# EAGLE design RobotPCB (EAGLE 9.2.2)
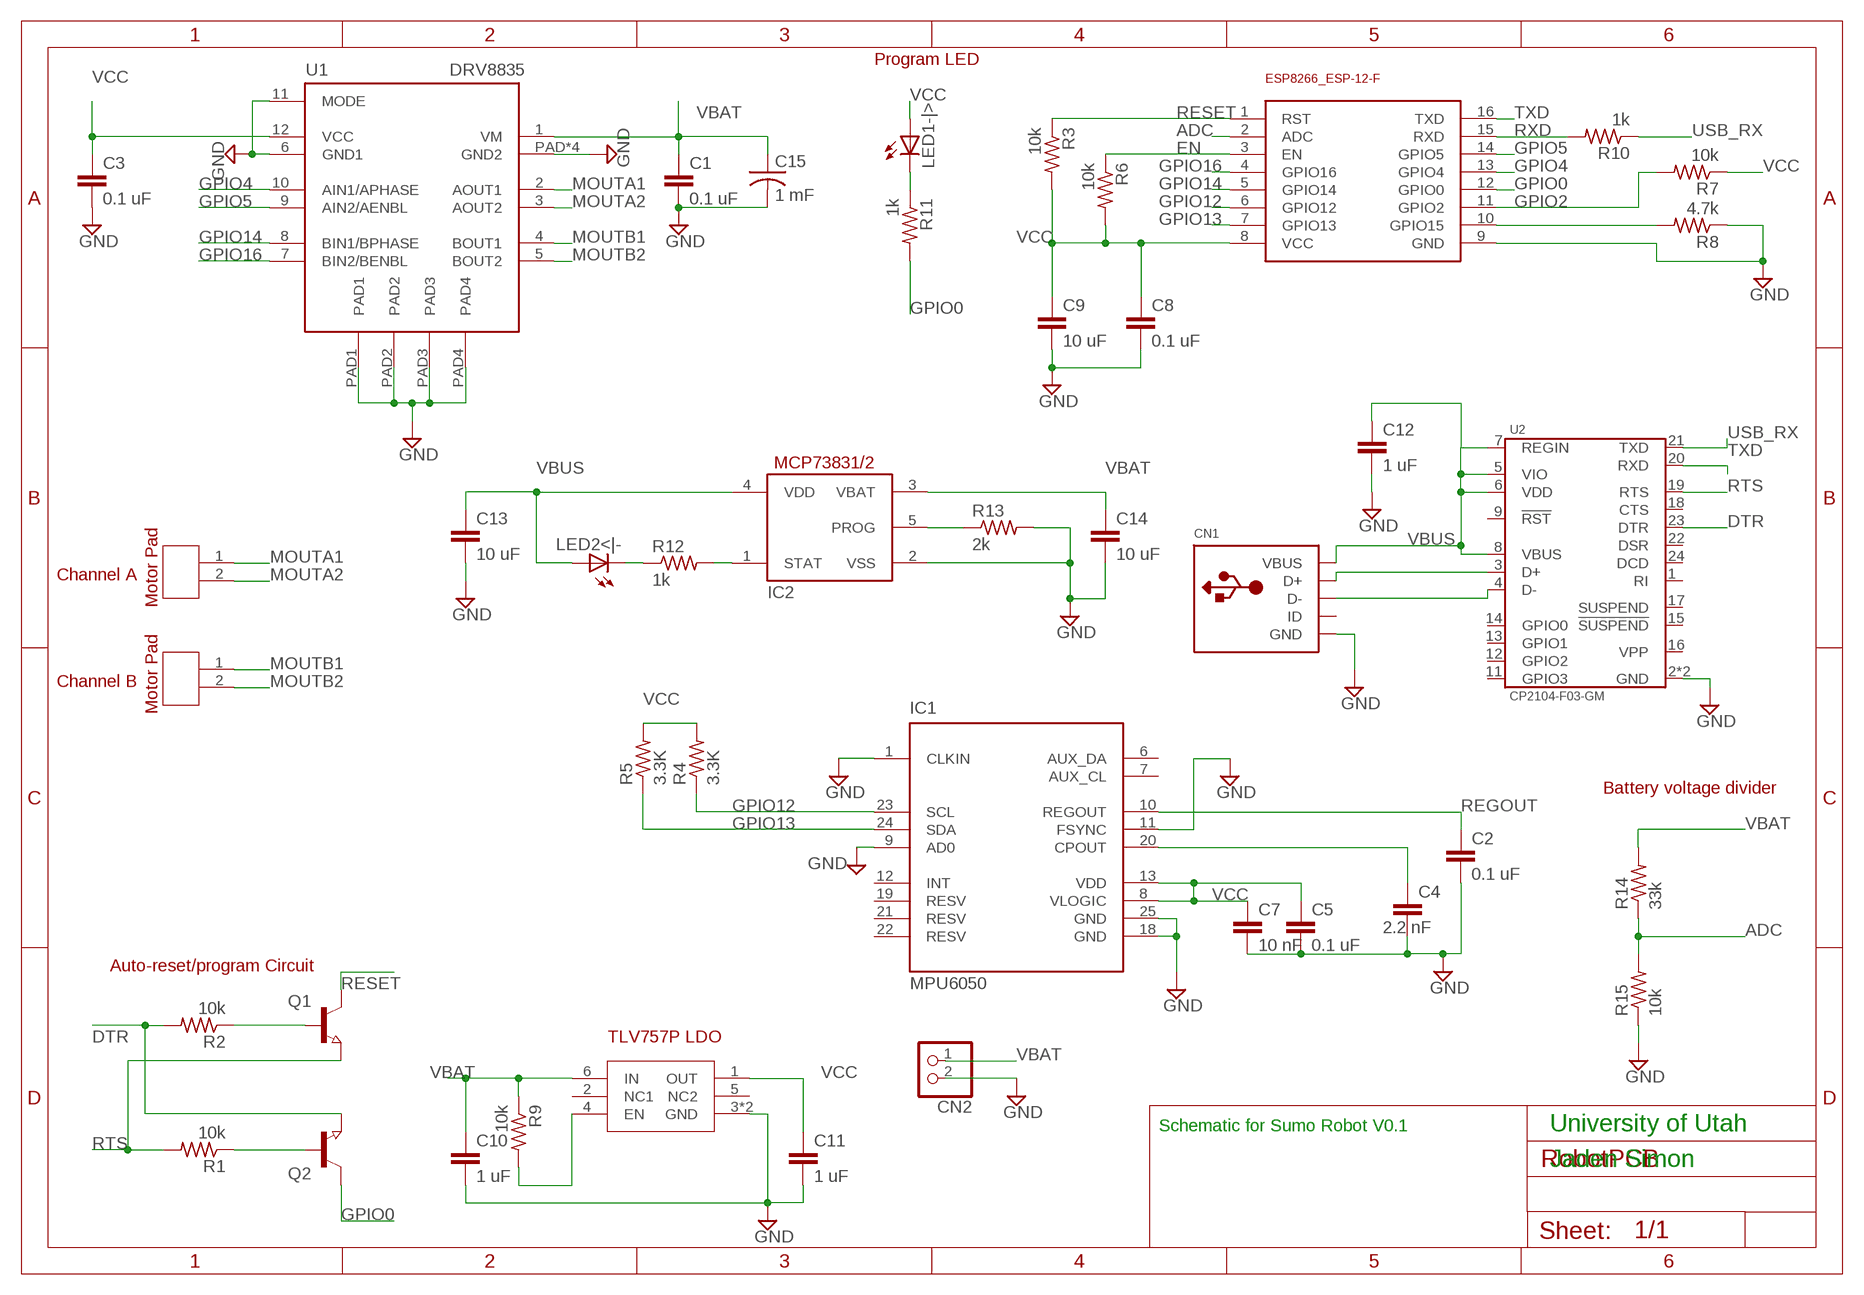
[diagram p0: schematic, sheet 1]

## Parts
C1  0.1 uF  C-EUC1206  [C1206]
C2  0.1 uF  C-EUC1206  [C1206]
C3  0.1 uF  C-EUC1206  [C1206]
C4  2.2 nF  C-EUC1206  [C1206]
C5  0.1 uF  C-EUC1206  [C1206]
C7  10 nF  C-EUC1206  [C1206]
C8  0.1 uF  C-EUC1206  [C1206]
C9  10 uF  C-EUC1206  [C1206]
C10  1 uF  C-EUC1206  [C1206]
C11  1 uF  C-EUC1206  [C1206]
C12  1 uF  C-EUC1206  [C1206]
C13  10 uF  C-EUC1206  [C1206]
C14  10 uF  C-EUC1206  [C1206]
C15  1 mF  C-US050-075X075  [C050-075X075]
CN1  USBMINIB  [USB-MINIB]
CN2  JST_2PIN-THM  [JST-PH-2-THM]
IC1  MPU6050  [QFN50P400X400X95-25T265X275N]
IC2  MCP73831/OT  [SOT23-5L]
LED1-|>  LEDSMT1206  [1206]
LED2<|-  LEDSMT1206  [1206]
Q1  NPN-TRANSISTOR_SOT23  [SOT23]
Q2  NPN-TRANSISTOR_SOT23  [SOT23]
R1  10k  R-US_M1206  [M1206]
R2  10k  R-US_M1206  [M1206]
R3  10k  R-US_M1206  [M1206]
R4  3.3K  R-US_M1206  [M1206]
R5  3.3K  R-US_M1206  [M1206]
R6  10k  R-US_M1206  [M1206]
R7  10k  R-US_M1206  [M1206]
R8  4.7k  R-US_M1206  [M1206]
R9  10k  R-US_M1206  [M1206]
R10  1k  R-US_M1206  [M1206]
R11  1k  R-US_M1206  [M1206]
R12  1k  R-US_M1206  [M1206]
R13  2k  R-US_M1206  [M1206]
R14  33k  R-US_M1206  [M1206]
R15  10k  R-US_M1206  [M1206]
U1  DRV8835  [WSON_2X3]
U2  CP2104-F03-GM  [QFN-24-4X4]
U$1  ESP8266_ESP-12  [ESP8266-ESP12]
U$2  TLV757P  [WSON-6]
U$3  MOTOR_PAD  [MOTOR_PAD]
U$4  MOTOR_PAD  [MOTOR_PAD]

## Nets
ADC: R14.1 R15.2 U$1.2(ADC)
DTR: Q2.2(E) R2.2 U2.23(DTR)
EN: R6.1 U$1.3(EN)
GND: C1.2 C2.2 C3.2 C4.2 C5.2 C7.2 C8.2 C9.2 C10.2 C11.2 C12.2 C13.2 C14.2 C15.2 CN1.GND CN2.2 IC1.1(CLKIN) IC1.9(AD0) IC1.11(FSYNC) IC1.18(GND) IC1.25(GND) IC2.2(VSS) R8.1 R13.2 R15.1 U1.6(GND1) U1.11(MODE) U1.PAD1 U1.PAD2 U1.PAD3 U1.PAD4 U1.PAD5(GND2) U1.PAD6(GND2) U1.PAD7(GND2) U1.PAD(GND2) U2.2(GND) U2.PAD(GND) U$1.9(GND) U$2.3(GND) U$2.7(GND)
GPIO0: Q2.3(C) R11.2 U$1.12(GPIO0)
GPIO2: R7.2 U$1.11(GPIO2)
GPIO4: U1.10(AIN1/APHASE) U$1.13(GPIO4)
GPIO5: U1.9(AIN2/AENBL) U$1.14(GPIO5)
GPIO12: IC1.23(SCL) R4.1 U$1.6(GPIO12)
GPIO13: IC1.24(SDA) R5.1 U$1.7(GPIO13)
GPIO14: U1.8(BIN1/BPHASE) U$1.5(GPIO14)
GPIO16: U1.7(BIN2/BENBL) U$1.4(GPIO16)
MOUTA1: U1.2(AOUT1) U$3.1(L)
MOUTA2: U1.3(AOUT2) U$3.2
MOUTB1: U1.4(BOUT1) U$4.1(L)
MOUTB2: U1.5(BOUT2) U$4.2
N$1: C4.1 IC1.20(CPOUT)
N$2: Q1.1(B) R2.1
N$3: R9.2 U$2.4(EN)
N$4: CN1.D+ U2.3(D+)
N$5: Q2.1(B) R1.1
N$7: CN1.D- U2.4(D-)
N$8: LED1-|>.C R11.1
N$9: IC2.5(PROG) R13.1
N$10: IC2.1(STAT) R12.2
N$11: LED2<|-.C R12.1
N$23: R8.2 U$1.10(GPIO15)
REGOUT: C2.1 IC1.10(REGOUT)
RESET: Q1.3(C) R3.1 U$1.1(RST)
RTS: Q1.2(E) R1.2 U2.19(RTS)
RXD: R10.2 U$1.15(RXD)
TXD: U2.20(RXD) U$1.16(TXD)
USB_RX: R10.1 U2.21(TXD)
VBAT: C1.1 C10.1 C14.1 C15.1 CN2.1 IC2.3(VBAT) R9.1 R14.2 U1.1(VM) U$2.6(IN)
VBUS: C12.1 C13.1 CN1.VBUS IC2.4(VDD) LED2<|-.A U2.5(VIO) U2.6(VDD) U2.7(REGIN) U2.8(VBUS)
VCC: C3.1 C5.1 C7.1 C8.1 C9.1 C11.1 IC1.8(VLOGIC) IC1.13(VDD) LED1-|>.A R3.2 R4.2 R5.2 R6.2 R7.1 U1.12(VCC) U$1.8(VCC) U$2.1(OUT)
Unconnected: CN1.ID IC1.2(NC) IC1.3(NC) IC1.4(NC) IC1.5(NC) IC1.6(AUX_DA) IC1.7(AUX_CL) IC1.12(INT) IC1.14(NC) IC1.15(NC) IC1.16(NC) IC1.17(NC) IC1.19(RESV) IC1.21(RESV) IC1.22(RESV) U2.1(RI) U2.9(!RST) U2.11(GPIO3) U2.12(GPIO2) U2.13(GPIO1) U2.14(GPIO0) U2.15(!SUSPEND) U2.16(VPP) U2.17(SUSPEND) U2.18(CTS) U2.22(DSR) U2.24(DCD) U$2.2(NC1) U$2.5(NC2)

## Notes on the sheet
- Program LED
- Channel A
- Channel B
- Battery voltage divider
- Auto-reset/program Circuit
- Schematic for Sumo Robot V0.1 | University of Utah
- Jaden Simon

## Library data of the parts
C1-C5 C7-C14 = rcl:C-EU: CAPACITOR, European symbol; SPICEPREFIX: C
C15 = rcl:C-US: CAPACITOR, American symbol; SPICEPREFIX: C
CN1 = adafruit:USB: USB Connectors USBMINIB - Surface Mount Female Mini-B USB Connector 4UConnector: 06564 By microbuilder.eu Thru-hole RA Female Mini-B USB Connector 4UConnector: 18732 By ladyada.net
CN2 = adafruit:JST_2PIN: JST 2-Pin Connectors of various flavors SMT-RA (S2B-PH-SM4) 4UConnector #17311 SMT (B2B-PH-SM4) THM-RA (S2B-PH) THM (B2B-PH)
IC1 = invensense:MPU6050: The triple-axis MEMS gyroscope
IC2 = adafruit:MCP73831: MCP73831/2 Miniature Single-Cell, Fully Integrated Li-Ion, Li-Polymer Charge Management Controllers. Nice and small simple lipoly charge controller, with adjustable current and status output (LED) http://www.ladyada.net/library/pcb/eaglelibrary.html
LED1-|> = adafruit:LED: LED
LED2<|- = led:LED: LED
Q1 Q2 = semicon-smd-ipc:NPN-TRANSISTOR_: NPN TRANSISTOR
R1-R15 = rcl:R-US_: RESISTOR, American symbol; SPICEPREFIX: R
U1 = bt_motordriver:DRV8835: DRV8835 DUAL LOW VOLTAGE H-BRIDGE IC The DRV8835 provides an integrated motor driver solution for cameras, consumer products, toys, and other low voltage or battery-powered motion control applications. The device has two H-bridge drivers, and can drive two DC motors or one stepper motor, as well as other devices like solenoids. The device has two H-bridge drivers, and drives two DC motors or one stepper motor, as well as other devices like solenoids. The output driver block for each consists of N-channel power MOSFETs configured as an H-bridge to drive the motor winding. An internal charge pump generates gate drive voltages. 1.5-A Maximum Drive Current Per H-Bridge Configure Bridges Parallel for 3-A Drive Curren 0-V to 11-V Motor-Operating Supply-Voltage 2-V to 7-V Logic Supply-Voltage Flexible PWM or PHASE/ENABLE Interface Low-Power Sleep Mode With 95-nA Maximum Supply Current Tiny 2.00-mm × 3.00-mm WSON Package Reference: http://www.ti.com/lit/ds/symlink/drv8835.pdf
U2 = silicon_labs:CP2104
U$1 = ESP8266:ESP8266_ESP-12
U$2 = ECE5780-MotorDriver:TLV757P
U$3 U$4 = ECE5780-MotorDriver:MOTOR_PAD

## Board
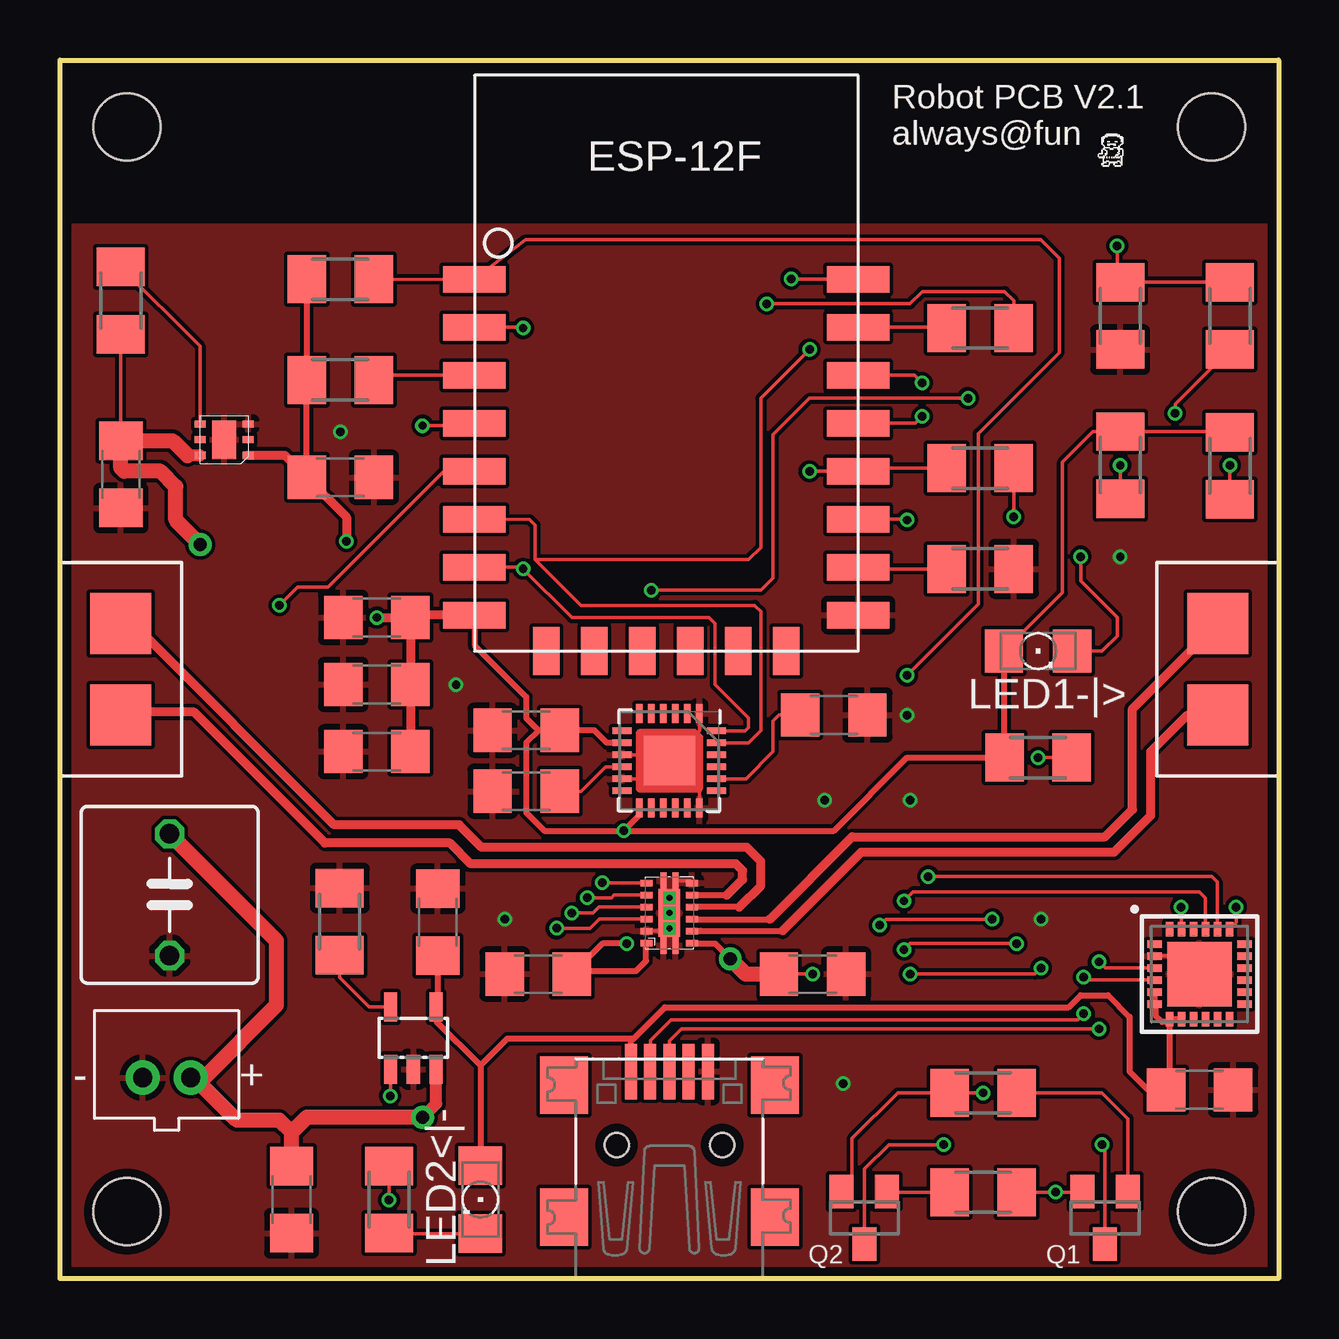
[diagram p1: board, top side]
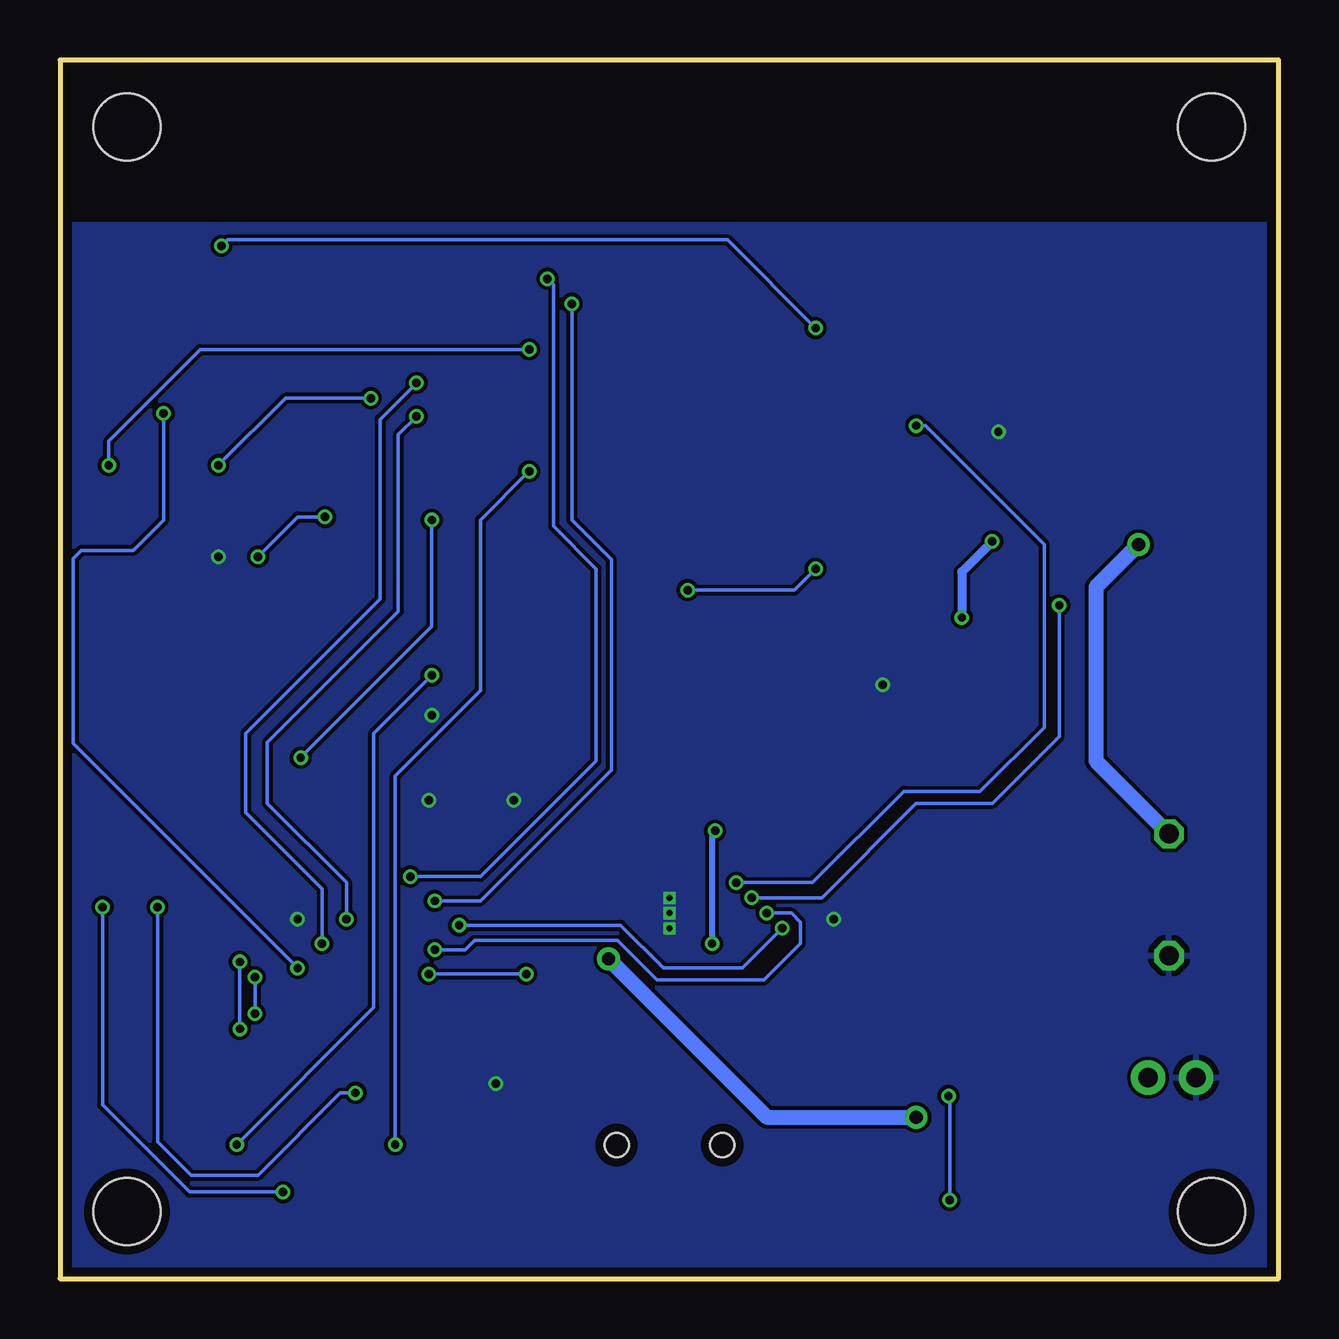
[diagram p2: board, bottom side, seen from below]

Size 50.8 x 50.8 mm. Coordinates in mm from the lower left corner, seen from the top.
Outline: 0,0 0,50.8 50.8,50.8 50.8,0 0,0
Copper layers (1*16): Top 0.035559375mm / dielectric 1.6mm / Bottom 0.035559375mm
Design rules "2layer": minimum track width 6mil, minimum drill 10mil, track to track 6mil, track to pad 6mil, pad to pad 6mil, via to via 6mil, smd to smd 6mil, copper to edge 15mil, drill to drill 6mil, minimum pad ring 5mil, minimum via ring 5mil, stop-mask expansion 2.5mil, vias tented up to drill 0mil, thermal gap 10mil
Holes 2.79 mm at 2.79,2.79 48.01,2.79 2.79,48.01 48.01,48.01

### Footprints (pad centres in the part's own frame; a part is rotated, then mirrored left to right if it is on the bottom)
C1206 = smd 1.6 x 1.8: 1 -1.4,0; 2 1.4,0
C050-075X075 = drill 0.813 octagon: 1 -2.54,0; 2 2.54,0
USB-MINIB = smd 0.5 x 2.308: D+ 0,4.064; D- -0.8,4.064; GND 1.6,4.064; ID 0.8,4.064; VBUS -1.6,4.064 | smd 2 x 2.4: GND1 -4.4,-2; GND2 -4.4,3.5; GND3 4.4,3.5; GND4 4.4,-2 | hole 1: -2.2,1; 2.2,1
JST-PH-2-THM = drill 0.8 pad 1.422: 1 1,0; 2 -1,0
QFN50P400X400X95-25T265X275N = smd 0.26 x 0.79: 1 -1.25,-1.97; 2 -0.75,-1.97; 3 -0.25,-1.97; 4 0.25,-1.97; 5 0.75,-1.97; 6 1.25,-1.97; 13 1.25,1.97; 14 0.75,1.97; 15 0.25,1.97; 16 -0.25,1.97; 17 -0.75,1.97; 18 -1.25,1.97 | smd 0.79 x 0.26: 7 1.97,-1.25; 8 1.97,-0.75; 9 1.97,-0.25; 10 1.97,0.25; 11 1.97,0.75; 12 1.97,1.25; 19 -1.97,1.25; 20 -1.97,0.75; 21 -1.97,0.25; 22 -1.97,-0.25; 23 -1.97,-0.75; 24 -1.97,-1.25 | smd 2.15 x 2.05: 25 0,0
SOT23-5L = smd 0.55 x 1.2: 1 -0.95,-1.3; 2 0,-1.3; 3 0.95,-1.3; 4 0.95,1.3; 5 -0.95,1.3
1206 = smd 1.6 x 1.803: A -1.422,0; C 1.422,0
SOT23 = smd 1 x 1.4: 1 -0.95,-1.1; 2 0.95,-1.1; 3 0,1.1
M1206 = smd 1.6 x 2: 1 -1.4,0; 2 1.4,0
WSON_2X3 = smd 0.28 x 0.5: 1 -1.25,-0.95; 2 -0.75,-0.95; 3 -0.25,-0.95; 4 0.25,-0.95; 5 0.75,-0.95; 6 1.25,-0.95; 7 1.25,0.95; 8 0.75,0.95; 9 0.25,0.95; 10 -0.25,0.95; 11 -0.75,0.95; 12 -1.25,0.95 | smd 2 x 0.9: PAD 0,0 | smd 0.7 x 0.25: PAD1 -1.35,0.25; PAD2 -1.35,-0.25; PAD3 1.35,-0.25; PAD4 1.35,0.25 | drill 0.254 pad 0.508 square: PAD5 -0.635,0; PAD6 0,0; PAD7 0.635,0
QFN-24-4X4 = smd 0.6 x 0.3: 1 -1.875,1.25; 2 -1.875,0.75; 3 -1.875,0.25; 4 -1.875,-0.25; 5 -1.875,-0.75; 6 -1.875,-1.25; 13 1.875,-1.25; 14 1.875,-0.75; 15 1.875,-0.25; 16 1.875,0.25; 17 1.875,0.75; 18 1.875,1.25 | smd 0.3 x 0.6: 7 -1.25,-1.875; 8 -0.75,-1.875; 9 -0.25,-1.875; 10 0.25,-1.875; 11 0.75,-1.875; 12 1.25,-1.875; 19 1.25,1.875; 20 0.75,1.875; 21 0.25,1.875; 22 -0.25,1.875; 23 -0.75,1.875; 24 -1.25,1.875 | smd 2.7 x 2.7: PAD 0,0
ESP8266-ESP12 = smd 2.6 x 1.1: 1 0,15.5; 2 0,13.5; 3 0,11.5; 4 0,9.5; 5 0,7.5; 6 0,5.5; 7 0,3.5; 8 0,1.5; 9 16,1.5; 10 16,3.5; 11 16,5.5; 12 16,7.5; 13 16,9.5; 14 16,11.5; 15 16,13.5; 16 16,15.5 | smd 1.1 x 2: 17 3,0; 18 5,0; 19 7,0; 20 9,0; 21 11,0; 22 13,0
WSON-6 = smd 0.45 x 0.3: 1 0,1.65; 2 0,1; 3 0,0.35; 4 2,0.35; 5 2,1; 6 2,1.65 | smd 1 x 1.6: 7 1,1
MOTOR_PAD = smd 2.54 x 2.54: 1 2.54,2.54; 2 6.35,2.54

### Placement (x,y rotation side)
C1  31.37,12.7 0 top
C2  19.43,20.32 180 top
C3  19.94,12.7 180 top
C4  32.26,23.5 0 top
C5  13.21,21.97 180 top
C7  19.43,22.86 180 top
C8  13.21,27.56 180 top
C9  13.21,24.77 180 top
C10  2.54,33.53 270 top
C11  11.68,33.4 0 top
C12  47.5,7.87 0 top
C13  15.75,14.86 90 top
C14  9.65,3.3 270 top
C15  4.57,16 270 top
CN1  25.4,4.57 0 top
CN2  4.45,8.38 0 top
IC1  25.4,21.59 180 top
IC2  14.73,10.03 0 top
LED1-|>  40.77,26.16 0 top
LED2<|-  17.53,3.3 270 top
Q1  43.56,2.54 180 top
Q2  33.53,2.54 180 top
R1  38.48,3.61 0 top
R2  38.48,7.75 180 top
R3  11.68,41.66 180 top
R4  48.77,33.88 90 top
R5  44.2,33.91 90 top
R6  11.68,37.47 180 top
R7  40.77,21.72 0 top
R8  38.35,29.59 180 top
R9  2.54,40.77 90 top
R10  38.35,39.62 180 top
R11  38.35,33.78 180 top
R12  13.72,3.3 90 top
R13  11.66,14.88 90 top
R14  48.77,40.13 270 top
R15  44.2,40.13 90 top
U1  25.4,15.24 90 top
U2  47.5,12.7 0 top
U$1  17.27,26.16 0 top
U$2  7.84,35.97 180 top
U$3  50.8,20.95 90 top
U$4  0,29.84 270 top

### Tracks (layer width: path | path; a pad name or v marks a point on that pad's centre or on a via)
ADC  (via drill 0.35, 0.35 pad 0.6)
  Top 0.152: v19.3,39.62 19.27,39.66 U$1.2 | R14.1 R15.2 44.07,41.66 v44.07,43.05
  Bottom 0.152: v44.07,43.05 43.81,43.31 22.99,43.31 v19.3,39.62
DTR  (via drill 0.35)
  Top 0.152: Q2.2 33.02,4.08 33.02,5.84 34.92,7.75 R2.2 v38.48,7.75 | v46.74,15.49 v46.75,15.48 U2.23
  Bottom 0.152: v46.74,15.49 46.74,5.71 45.34,4.32 42.55,4.32 39.12,7.75 v38.48,7.75
EN
  Top 0.152: R6.1 13.59,37.47 13.79,37.66 U$1.3
GND  (via drill 0.35)
  Top 0.152: IC1.9 25.15,21.84 IC1.25 | IC1.1 26.65,22.84 25.46,21.65 | 25.46,21.65 IC1.25 | IC1.18 26.65,20.47 25.46,21.65 | U2.2 47.5,13.45 U2.PAD | IC1.11 24.65,20.84 IC1.25 | U1.6 26.25,16.59 U1.PAD3 | 24.9,14.49 25.4,14.99 U1.PAD6 25.15,15.49 U1.PAD4 | 24.9,14.49 U1.11 | U1.PAD1 25.15,14.24 24.9,14.49 | U1.PAD2 25.65,14.36 U1.PAD5
  other vias: 31.88,19.94 18.54,14.99 11.68,35.31 40.89,14.99 32.64,8.13 44.2,30.1 35.43,19.94 16.51,24.77 35.31,23.5
  pour Top: 0,0 0,43.94 50.8,43.94 50.8,0
  pour Bottom: 0,0 0,43.94 50.8,43.94 50.8,0
GPIO0  (via drill 0.35)
  Top 0.152: v36.83,5.59 34.54,5.59 33.53,4.57 Q2.3 | R11.2 33.39,33.78 U$1.12 v31.25,33.66 v31.24,33.66 | Q2.3
  Bottom 0.152: v36.83,5.59 36.83,20.95 33.27,24.51 33.27,31.62 v31.24,33.66
GPIO2  (via drill 0.35)
  Top 0.152: U$1.11 35.27,31.66 v35.31,31.62 | v40.77,21.72 R7.2
  Bottom 0.152: v35.31,31.62 35.31,27.18 v40.77,21.72
GPIO4  (via drill 0.35)
  Top 0.152: U1.10 22.48,14.99 22.1,14.61 v20.7,14.61 | U$1.13 35.66,35.66 v35.94,35.94 | v38.86,14.99 34.42,14.99 v34.16,14.73
  Bottom 0.152: v35.94,35.94 36.7,35.18 36.7,27.81 42.16,22.35 42.16,19.81 38.86,16.51 v38.86,14.99 | v34.16,14.73 27.43,14.73 25.65,12.95 22.35,12.95 v20.7,14.61
GPIO5  (via drill 0.35)
  Top 0.152: U1.9 22.48,15.49 22.23,15.24 v21.34,15.24 | U$1.14 35.62,37.66 v35.94,37.34 | v39.88,13.97 35.43,13.97 v35.18,13.72
  Bottom 0.152: v35.94,37.34 37.47,35.81 37.47,28.32 43.05,22.73 43.05,19.43 39.88,16.26 v39.88,13.97 | v35.18,13.72 33.91,13.72 33.53,14.1 27.56,14.1 25.91,12.45 21.46,12.45 19.94,13.97 19.94,14.86 20.32,15.24 v21.34,15.24
GPIO12  (via drill 0.35)
  Top 0.152: U$1.6 19.58,31.64 19.81,31.41 19.81,29.97 | 19.81,29.97 21.72,28.07 28.96,28.07 29.21,27.81 29.21,22.86 28.69,22.34 IC1.23 | R4.1 v48.77,33.91 | v31.24,38.73 29.21,36.7 29.21,30.48 28.7,29.97 19.81,29.97
  Bottom 0.152: v48.77,33.91 48.77,34.92 44.96,38.73 v31.24,38.73
GPIO13  (via drill 0.35)
  Top 0.152: IC1.24 28.55,22.84 28.7,22.99 28.7,23.37 27.3,24.77 27.3,27.3 27.05,27.56 21.34,27.56 v19.3,29.59 19.23,29.66 U$1.7 | R5.1 v44.2,33.91 | v24.64,28.7 29.21,28.7 29.72,29.21 29.72,35.18 31.24,36.7 v37.85,36.7
  Bottom 0.152: v44.2,33.91 41.4,36.7 v37.85,36.7 | v24.64,28.7 20.19,28.7 v19.3,29.59
GPIO14  (via drill 0.35)
  Top 0.152: U1.8 23.1,15.99 22.99,15.88 v21.97,15.88 | v9.14,28.07 9.91,28.83 11.18,28.83 16.01,33.66 U$1.5
  Bottom 0.152: v21.97,15.88 19.05,15.88 15.11,19.81 11.94,19.81 9.14,22.61 v9.14,28.07
GPIO16  (via drill 0.35)
  Top 0.152: U1.7 22.63,16.49 v22.61,16.51 | v15.11,35.56 17.17,35.56 U$1.4
  Bottom 0.152: v22.61,16.51 19.43,16.51 15.62,20.32 12.45,20.32 9.78,22.99 9.78,30.61 14.73,35.56 v15.11,35.56
MOUTA1
  Top 0.254: U1.2 26.69,14.49 26.7,14.5 30.12,14.5
  Top 0.381: 30.12,14.5 33.4,17.78 43.94,17.78 45.47,19.3 45.47,21.97 46.99,23.5 U$3.1
MOUTA2
  Top 0.254: U1.3 29.59,14.99
  Top 0.381: U$3.2 44.7,23.75 44.7,19.56 43.56,18.41 33.02,18.41 29.59,14.99
MOUTB1
  Top 0.254: 28.32,15.49 U1.4
  Top 0.381: 28.32,15.49 29.21,16.38 29.21,17.4 28.63,17.98 17.58,17.98 16.64,18.92 11.43,18.92 3.05,27.3 U$4.1
MOUTB2
  Top 0.254: U1.5 27.8,15.99
  Top 0.381: 27.8,15.99 28.45,16.64 28.45,17.02 28.17,17.3 17.12,17.3 16.26,18.16 11.05,18.16 5.59,23.62 2.67,23.62 U$4.2
N$1
  Top 0.152: C4.1 29.97,23.5 29.72,23.24 29.72,21.97 28.59,20.84 IC1.20
N$2
  Top 0.152: R2.1 43.43,7.75 44.51,6.67 Q1.1
N$3
  Top 0.152: R9.2 5.84,38.87 U$2.4
N$4  (via drill 0.35)
  Top 0.152: CN1.D+ 25.4,9.91 25.91,10.41 v43.31,10.41 | v43.31,13.21 43.56,12.95 U2.3
  Bottom 0.152: v43.31,13.21 v43.31,10.41
N$5
  Top 0.152: R1.1 34.51,3.61 Q2.1
N$7  (via drill 0.35)
  Top 0.152: CN1.D- 24.61,8.65 24.61,9.93 25.48,10.79 42.42,10.79 v42.67,11.05 | v42.67,12.57 42.8,12.45 U2.4
  Bottom 0.152: v42.67,12.57 v42.67,11.05
N$8  (via drill 0.35)
  Top 0.152: R11.1 39.82,33.72 39.75,33.66 v39.75,31.75 | LED1-|>.C 43.43,26.16 44.07,26.8 44.07,27.56 42.55,29.08 v42.55,30.1
  Bottom 0.152: v42.55,30.1 40.89,31.75 v39.75,31.75
N$9
  Top 0.152: IC2.5 12.89,11.33 11.66,12.57 R13.1
N$10  (via drill 0.35)
  Top 0.152: IC2.1 13.78,7.63 v13.77,7.62 | v13.72,3.28 R12.2
  Bottom 0.152: v13.77,7.62 13.72,7.57 v13.72,3.28
N$11
  Top 0.152: R12.1 13.74,1.88 LED2<|-.C
N$23
  Top 0.152: R8.2 32.92,29.59 U$1.10
REGOUT
  Top 0.152: IC1.10 22.74,21.34 21.72,20.32 C2.1
RESET  (via drill 0.35)
  Top 0.152: v43.43,5.59 43.56,5.46 Q1.3 | R3.1 13.1,41.64 U$1.1 19.41,43.31 40.89,43.31 41.66,42.55 41.66,38.61 38.28,35.23 38.28,28.12 v35.31,25.15
  Bottom 0.152: v43.43,5.59 37.72,11.3 37.72,22.73 v35.31,25.15
RTS  (via drill 0.35)
  Top 0.152: Q1.2 42.58,3.61 v41.5,3.61 R1.2 | U2.19 49.02,14.85 v49.02,15.49
  Bottom 0.152: v49.02,15.49 49.02,7.24 45.4,3.62 41.52,3.62 v41.5,3.61
RXD
  Top 0.152: U$1.15 36.92,39.66 R10.2
TXD  (via drill 0.35)
  Top 0.152: U$1.16 32.86,41.66 30.48,41.66 v30.48,41.68 | U2.20 48.24,14.59 48.24,16.53 48.01,16.76 v36.2,16.76
  Bottom 0.152: v36.2,16.76 33.27,16.76 28.45,21.59 28.45,29.59 30.23,31.37 30.23,41.43 v30.48,41.68
USB_RX  (via drill 0.35)
  Top 0.152: v29.46,40.64 35.43,40.64 35.94,41.15 39.37,41.15 39.75,40.76 R10.1 | U2.21 47.75,15.88 47.5,16.13 35.56,16.13 v35.18,15.75
  Bottom 0.152: v35.18,15.75 33.27,15.75 27.81,21.21 27.81,29.97 29.46,31.62 v29.46,40.64
VBAT  (via drill 0.35, 0.55 pad 0.95)
  Top 0.152: C10.1 R9.1 | R14.2 46.48,36.45 v46.48,36.07 | v40.89,12.95 40.64,12.7 v35.43,12.7 | v31.37,12.7 C1.1
  Top 0.254: U1.1 26.37,13.97 27.3,13.97 v27.94,13.34
  Top 0.508: v15.11,6.73 15.68,7.3 IC2.3 | 2.67,33.66 2.54,33.78 | U$2.6 5.33,34.32 5.32,34.31
  Top 0.635: C14.1 9.65,6.1 | v27.94,13.34 28.57,12.7 C1.1 | C15.1 9.02,14.1 9.02,11.4 6,8.38 CN2.1 5.59,8.38 7.37,6.6 9.14,6.6 9.65,6.1 | v5.84,30.61 4.83,31.62 4.83,33.02 4.19,33.66 2.67,33.66 | 2.54,33.78 C10.1 4.7,34.93 5.32,34.31 | 9.65,6.1 10.29,6.73 v15.11,6.73
  Bottom 0.152: v46.48,36.07 46.48,31.62 47.75,30.35 49.91,30.35 50.24,30.02 50.24,22.3 v40.89,12.95 | v35.43,12.7 v31.37,12.7
  Bottom 0.635: v27.94,13.34 21.34,6.73 v15.11,6.73 | v5.84,30.61 7.62,28.83 7.62,21.59 C15.1
VBUS
  Top 0.152: U2.7 46.12,10.7 | 45.66,11.42 U2.6
  Top 0.254: CN1.VBUS 23.8,9.91 23.9,10.01 | U2.8 U2.7 46.25,8.02 C12.1 45.34,7.87 44.58,8.64 44.58,10.92 43.69,11.81 42.55,11.81 42.05,11.31 25.21,11.31 23.9,10.01 | 46.12,10.7 45.94,10.7 45.66,10.99 45.66,11.42 | U2.5 U2.6 | C13.1 15.75,11.4 IC2.4 15.68,10.73 17.53,8.89 | 23.9,10.01 18.64,10.01 17.53,8.89 | 17.53,8.89 LED2<|-.A
VCC  (via drill 0.35)
  Top 0.152: 17.29,27.64 U$1.8 | R4.2 48.74,35.31 R5.2 43.06,35.31 41.78,34.04 41.78,28.6 LED1-|>.A 39.37,26.14
  Top 0.254: IC1.13 24.15,19.32 v23.5,18.67 | R3.2 R6.2 C11.1 | 17.29,27.64 17.29,26.4 19.43,24.26 19.43,23.37 19.94,22.86 | IC1.8 22.8,22.34 22.27,22.86 C7.1 19.94,22.86 | 14.71,27.66 C8.1 | 19.94,22.86 19.43,22.35 19.43,19.43 20.19,18.67 v23.5,18.67 | U1.12 24.43,13.97 24.43,13.25 24,12.83 21.47,12.83 C3.1 22.61,13.97 v23.62,13.97 | 39.37,26.14 R7.1 35.31,21.72 32.26,18.67 v23.5,18.67
  Top 0.381: U$1.8 14.71,27.66 | C5.1 C9.1 C8.1 v13.21,27.56 | U$2.1 9.36,34.32 C11.1 11.94,31.75 v11.94,30.73
  Bottom 0.254: v23.5,18.67 23.62,18.54 v23.62,13.97
  Bottom 0.381: v11.94,30.73 13.21,29.46 v13.21,27.56

### Text on the board
tPlace: Robot PCB V2.1 / always@fun